# EAGLE design pic_dfn (EAGLE 7.5.0)
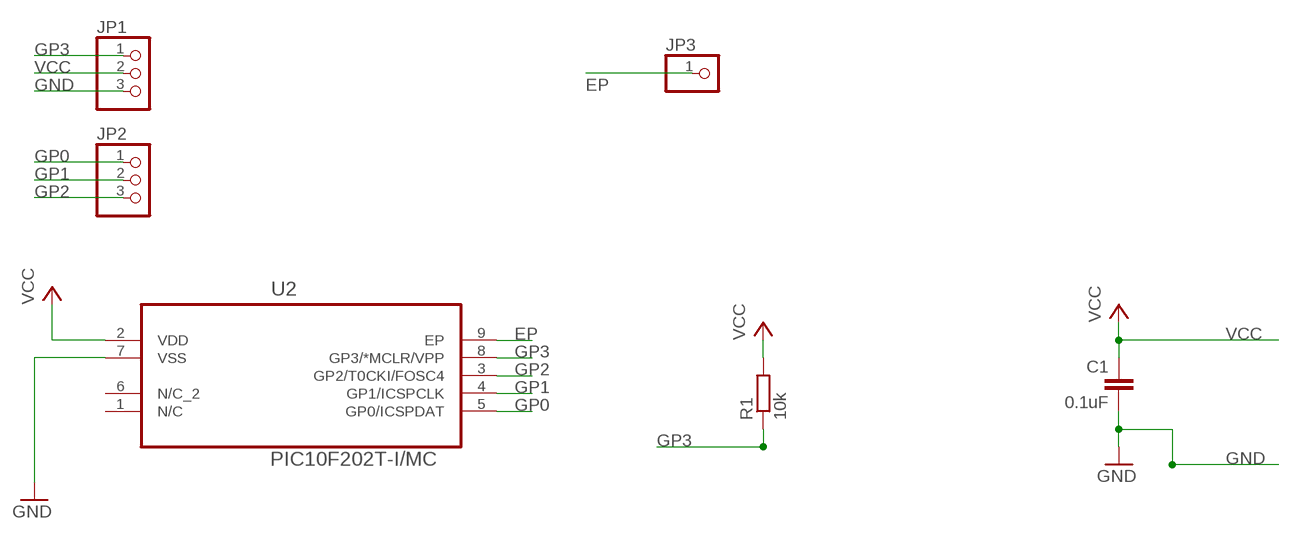
[diagram p0: schematic, sheet 1]

## Parts
C1  0.1uF  C-EUC0603  [C0603]
JP1  PINHD-1X3  [1X03]
JP2  PINHD-1X3  [1X03]
JP3  PINHD-1X1  [1X01]
R1  10k  R-EU_R0603  [R0603]
U2  PIC10F202T-I/MC  [DFN200X300X100-9N]

## Nets
EP: JP3.1 U2.9(EP)
GND [GND]: C1.2 JP1.3 U2.7(VSS)
GP0: JP2.1 U2.5(GP0/ICSPDAT)
GP1: JP2.2 U2.4(GP1/ICSPCLK)
GP2: JP2.3 U2.3(GP2/T0CKI/FOSC4)
GP3: JP1.1 R1.1 U2.8(GP3/*MCLR/VPP)
VCC [VCC]: C1.1 JP1.2 R1.2 U2.2(VDD)
Unconnected: U2.1(N/C) U2.6(N/C_2)

## Library data of the parts
C1 = resistor:C-EU: CAPACITOR, European symbol
JP1 JP2 = pinhead:PINHD-1X3: PIN HEADER
JP3 = pinhead:PINHD-1X1: PIN HEADER
R1 = resistor:R-EU_: RESISTOR, European symbol
U2 = thierry_eagle:PIC10F202T-I/MC: 8BIT FLASH MCU, SMD, 10F202; MPN: PIC10F202T-I/MC; OC_FARNELL: 1332171; OC_NEWARK: 34M7945; PACKAGE: DFN-8; SUPPLIER: MICROCHIP

## Net classes
0 default: width 0.254 mm, drill 0.508 mm
1 GND: width 0.305 mm, drill 0.508 mm
2 VCC: width 0.305 mm, drill 0.508 mm

## Board
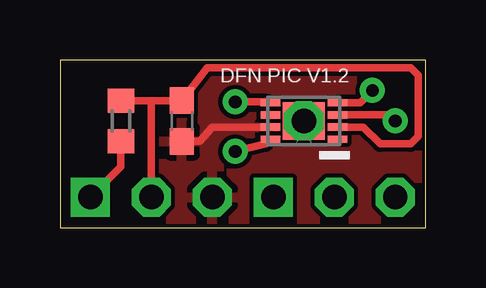
[diagram p1: board, top side]
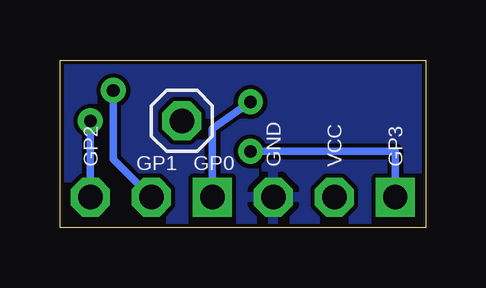
[diagram p2: board, bottom side, seen from below]

Size 15.24 x 6.98 mm. Coordinates in mm from the lower left corner, seen from the top.
Outline: 0,0 15.24,0 15.24,6.98 0,6.98 0,0
Copper layers (1*16): Top 0.035mm / dielectric 1.5mm / Bottom 0.035mm
Design rules "SparkFun *": minimum track width 10mil, minimum drill 20mil, track to track 7mil, track to pad 7mil, pad to pad 7mil, via to via 7mil, smd to smd 7mil, copper to edge 6mil, drill to drill 6mil, minimum pad ring 12mil, minimum via ring 10mil, stop-mask expansion 4mil, vias tented up to drill 25mil, thermal gap 10mil

### Footprints (pad centres in the part's own frame; a part is rotated, then mirrored left to right if it is on the bottom)
C0603 = smd 1.1 x 1: 1 -0.85,0; 2 0.85,0
1X03 = drill 1.016 square: 1 -2.54,0 | drill 1.016 octagon: 2 0,0; 3 2.54,0
1X01 = drill 1.016 octagon: 1 0,0
R0603 = smd 1 x 1.1: 1 -0.85,0; 2 0.85,0
DFN200X300X100-9N = smd 0.813 x 0.305: 1 -1.397,0.762; 2 -1.397,0.254; 3 -1.397,-0.254; 4 -1.397,-0.762; 5 1.397,-0.762; 6 1.397,-0.254; 7 1.397,0.254; 8 1.397,0.762 | smd 1.753 x 1.549: 9 0,0

### Placement (x,y rotation side)
C1  5.08,4.44 270 top
JP1  3.81,1.27 0 top
JP2  11.43,1.27 0 top
JP3  10.16,4.44 0 bottom
R1  2.54,4.44 90 top
U2  10.16,4.44 180 top

### Tracks (layer width: path | path; a pad name or v marks a point on that pad's centre or on a via)
EP
  Top 0.406: 10.16,4.29 JP3.1
GND
  Top 0.305: U2.7 6.35,4.19 5.82,3.6 C1.2
  pour Top: -0.32,7.62 15.56,7.62 15.56,-0.32 -0.32,-0.32
  pour Bottom: -0.32,7.62 15.56,7.62 15.56,-0.32 -0.32,-0.32
GP0  (via drill 0.53)
  Top 0.305: U2.5 8.64,5.24 v7.3,5.24
  Bottom 0.305: v7.3,5.24 8.89,4.13 JP2.1
GP1  (via drill 0.53)
  Top 0.305: v13.02,5.71 12.51,5.21 U2.4
  Bottom 0.305: JP2.2 13.02,2.86 v13.02,5.71
GP2  (via drill 0.53)
  Top 0.305: v13.97,4.44 13.72,4.7 U2.3
  Bottom 0.305: JP2.3 v13.97,4.44
GP3  (via drill 0.53)
  Top 0.305: JP1.1 2.54,2.54 R1.1 | U2.8 8.57,3.49 v7.3,3.17
  Bottom 0.305: v7.3,3.17 1.27,3.17 JP1.1
VCC
  Top 0.305: R1.2 3.81,5.29 | 3.81,5.29 C1.1 6.13,6.67 14.61,6.67 14.92,6.35 14.92,3.81 14.61,3.49 13.34,3.49 12.64,4.19 U2.2 | JP1.2 3.81,5.29

### Text on the board
tNames: DFN PIC V1.2
bNames: GP3 | VCC | GND | GP0 | GP1 | GP2